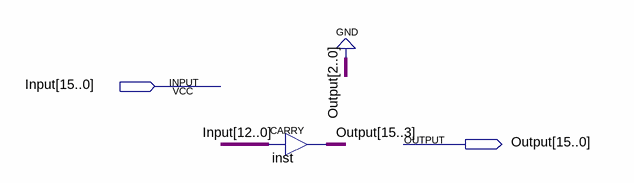
[diagram p0: schematic sheet]
// Quartus schematic Shift_Left_3bit.bdf as structural Verilog: 1 symbols, 2 pins
module Shift_Left_3bit (
  input  [15:0] Input,
  output [15:0] Output
);

  CARRY inst[12:0] (.IN(Input[12:0]), .OUT(Output[15:3]));

  assign Output[2:0] = 3'b000;
endmodule
